# Altium schematic sheet ee107_mcu_fpga_connector_board.SchDoc
size A
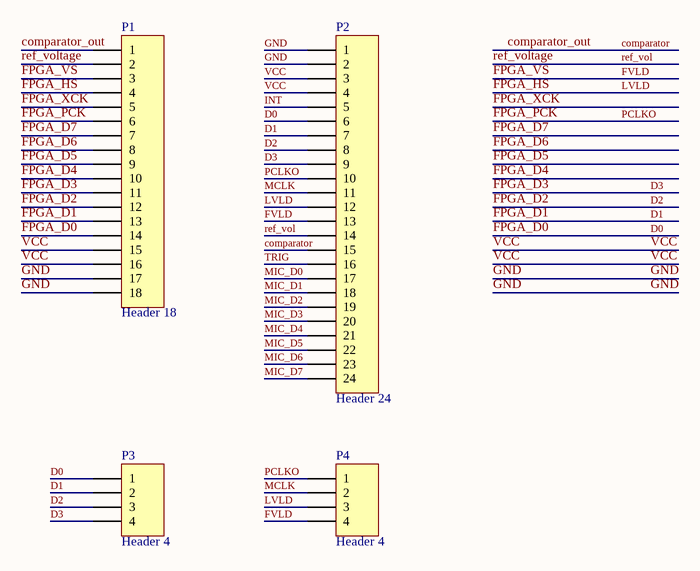
[diagram p0: ee107_mcu_fpga_connector_board.SchDoc]

## Parts
P1  Header 18  [HDR1X18]
P2  Header 24  [HDR1X24]
P3  Header 4  [HDR1X4]
P4  Header 4  [HDR1X4]

## Nets
comparator: P1.1 P2.15  [also labelled comparator_out]
D0: P1.14 P2.6 P3.1  [also labelled FPGA_D0]
D1: P1.13 P2.7 P3.2  [also labelled FPGA_D1]
D2: P1.12 P2.8 P3.3  [also labelled FPGA_D2]
D3: P1.11 P2.9 P3.4  [also labelled FPGA_D3]
FPGA_D4: P1.10
FPGA_D5: P1.9
FPGA_D6: P1.8
FPGA_D7: P1.7
FPGA_HS: P1.4 P2.12 P4.3  [also labelled LVLD]
FPGA_PCK: P1.6 P2.10 P4.1  [also labelled PCLKO]
FPGA_VS: P1.3 P2.13 P4.4  [also labelled FVLD]
FPGA_XCK: P1.5
GND: P1.17 P1.18 P2.1 P2.2
INT: P2.5
MCLK: P2.11 P4.2
MIC_D0: P2.17
MIC_D1: P2.18
MIC_D2: P2.19
MIC_D3: P2.20
MIC_D4: P2.21
MIC_D5: P2.22
MIC_D6: P2.23
MIC_D7: P2.24
ref_vol: P1.2 P2.14  [also labelled ref_voltage]
TRIG: P2.16
VCC: P1.15 P1.16 P2.3 P2.4

## Library data of the parts
P1 = Header 18: Header, 18-Pin; LatestRevisionDate: 17-Jul-2002; LatestRevisionNote: Re-released for DXP Platform.; Publisher: Altium Limited
P2 = Header 24: Header, 24-Pin; LatestRevisionDate: 17-Jul-2002; LatestRevisionNote: Re-released for DXP Platform.; Publisher: Altium Limited
P3 P4 = Header 4: Header, 4-Pin; LatestRevisionDate: 17-Jul-2002; LatestRevisionNote: Re-released for DXP Platform.; Publisher: Altium Limited